# Altium schematic sheet Audio.SchDoc
size A4; DocumentNumber: 4; Revision: B.2(PCB.SCH); SheetNumber: 4; SheetTotal: 6
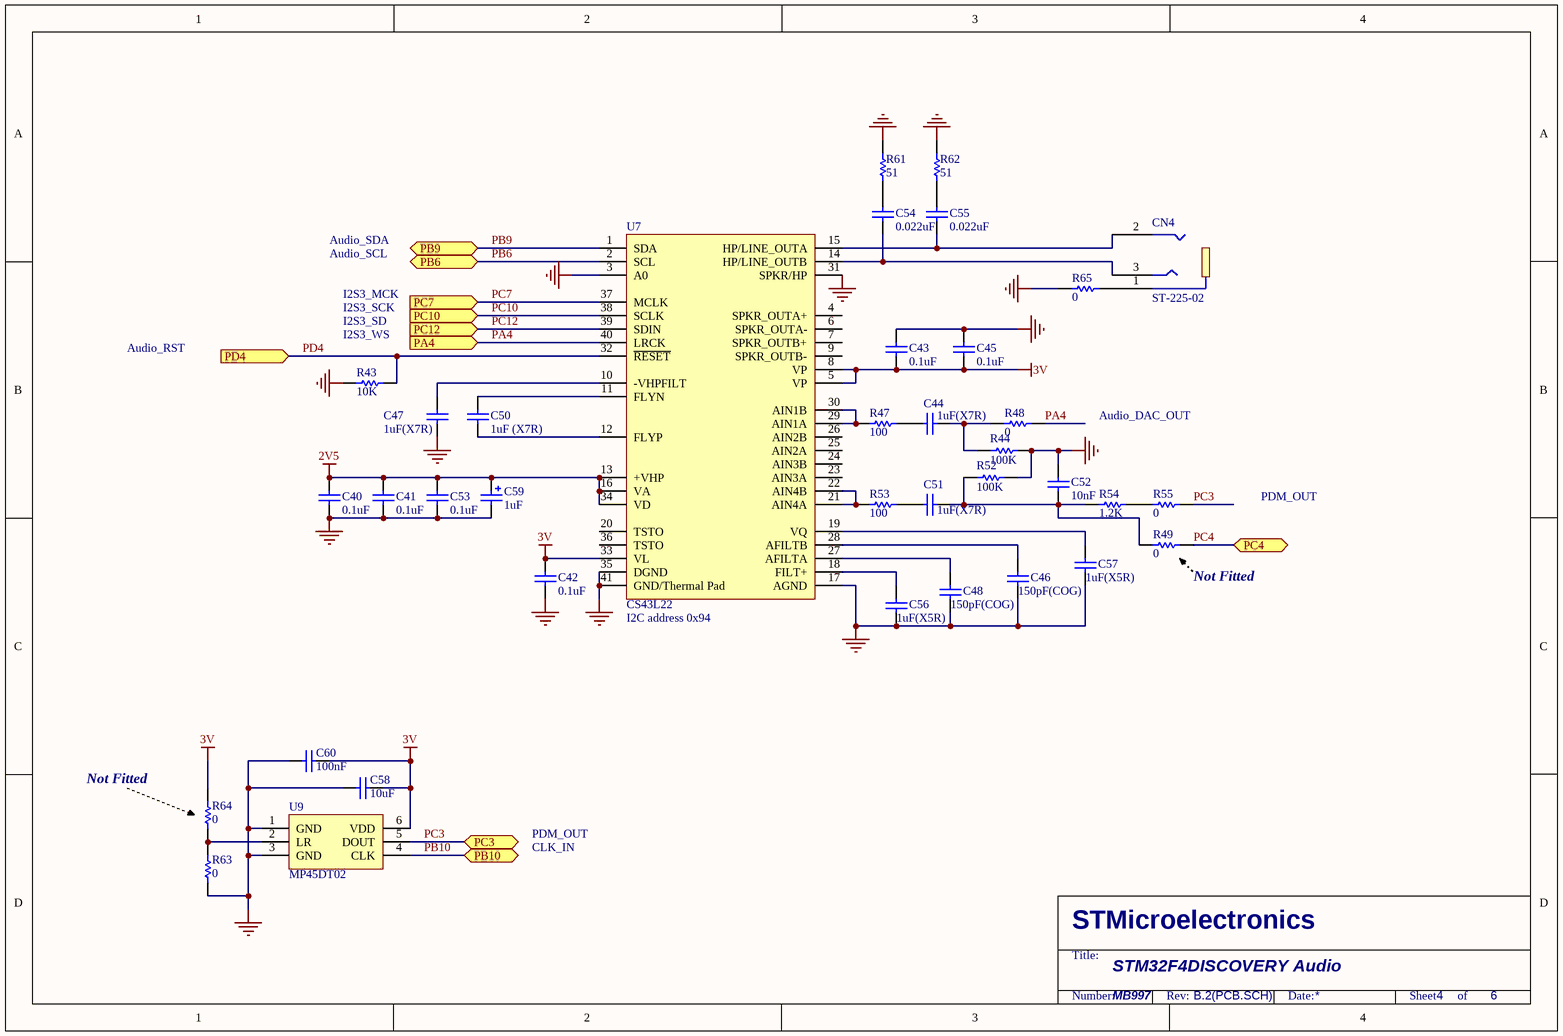
[diagram p0: Audio.SchDoc]

## Parts
C40  0.1uF  [0402C]
C41  0.1uF  [0402C]
C42  0.1uF  [0402C]
C43  0.1uF  [0402C]
C44  1uF(X7R)  [0603C]
C45  0.1uF  [0402C]
C46  150pF(COG)  [0603C]
C47  1uF(X7R)  [0603C]
C48  150pF(COG)  [0603C]
C50  1uF (X7R)  [0603C]
C51  1uF(X7R)  [0603C]
C52  10nF  [0603C]
C53  0.1uF  [0402C]
C54  0.022uF  [0603C]
C55  0.022uF  [0603C]
C56  1uF(X5R)  [0603C]
C57  1uF(X5R)  [0603C]
C58  10uF  [0603C]
C59  1uF  [TAN-A]
C60  100nF  [0603C]
CN4  ST-225-02  [Jack-ST-225]
R43  10K  [0402R]
R44  100K  [0402R]
R47  100  [0603R]
R48  0  [0402R]
R49  0  [0402R]
R52  100K  [0402R]
R53  100  [0603R]
R54  1.2K  [0603R]
R55  0  [0402R]
R61  51  [0603R]
R62  51  [0603R]
R63  0  [0402R]
R64  0  [0402R]
R65  0  [0402R]
U7  CS43L22  [QFN40]
U9  MP45DT02  [HLGA-4.72-3.76-6LD]

## Ports
PA4 (in), PB6 (bidir), PB9 (bidir), PB10, PC3, PC4, PC7 (in), PC10 (in), PC12 (in), PD4 (in)

## Nets
2V5: C40.2 C41.2 C53.2 C59.1 U7.13(+VHP) U7.16(VA) U7.34(VD)
3V: C42.2 C43.2 C45.2 C58.2 C60.2 R64.2 U7.5(VP) U7.8(VP) U7.33(VL) U9.6(VDD)
GND: C40.1 C41.1 C42.1 C43.1 C45.1 C46.1 C47.2 C48.1 C52.2 C53.1 C56.1 C57.1 C58.1 C59.2 C60.1 R43.2 R44.2 R52.2 R61.1 R62.1 R63.1 R65.2 U7.3(A0) U7.17(AGND) U7.31(SPKR/HP) U7.35(DGND) U7.41(GND/Thermal_Pad) U9.1(GND) U9.3(GND)
PA4: R48.1 U7.40(LRCK) ; port PA4
PB6: U7.2(SCL) ; port PB6
PB9: U7.1(SDA) ; port PB9
PB10: U9.4(CLK) ; port PB10
PC3: R55.1 U9.5(DOUT) ; port PC3
PC4: R49.1 ; port PC4
PC7: U7.37(MCLK) ; port PC7
PC10: U7.38(SCLK) ; port PC10
PC12: U7.39(SDIN) ; port PC12
PD4: R43.1 U7.32(~{RESET}) ; port PD4
NetC44_1: C44.1 R47.1
NetC44_2: C44.2 R44.1 R48.2
NetC46_2: C46.2 U7.28(AFILTB)
NetC47_1: C47.1 U7.10(-VHPFILT)
NetC48_2: C48.2 U7.27(AFILTA)
NetC50_1: C50.1 U7.12(FLYP)
NetC50_2: C50.2 U7.11(FLYN)
NetC51_1: C51.1 R53.1
NetC51_2: C51.2 C52.1 R49.2 R52.1 R54.1
NetC54_1: C54.1 R61.2
NetC54_2: C54.2 CN4.3 U7.14(HP/LINE_OUTB)
NetC55_1: C55.1 R62.2
NetC55_2: C55.2 CN4.2 U7.15(HP/LINE_OUTA)
NetC56_2: C56.2 U7.18(FILT+)
NetC57_2: C57.2 U7.19(VQ)
NetCN4_1: CN4.1 R65.1
NetR47_2: R47.2 U7.29(AIN1A) U7.30(AIN1B)
NetR53_2: R53.2 U7.21(AIN4A) U7.22(AIN4B)
NetR54_2: R54.2 R55.2
NetR63_2: R63.2 R64.1 U9.2(LR)

Not connected (* = marked no-connect by the designer): U7 4(SPKR_OUTA+) 6(SPKR_OUTA-) 7(SPKR_OUTB+) 9(SPKR_OUTB-) 20(TSTO) 23(AIN3A) 24(AIN3B) 25(AIN2A) 26(AIN2B) 36(TSTO)

## Notes on the sheet
- Audio_SDA
- Audio_SCL
- I2S3_MCK
- I2S3_SCK
- Audio_RST
- (near R43) I2S3_WS
- I2S3_SD
- Audio_DAC_OUT
- PDM_OUT
- (near R49) Not Fitted
- (near U7) I2C address 0x94
- (near R64) Not Fitted
- CLK_IN
- STM32F4DISCOVERY Audio
- MB997
- STMicroelectronics
- Title:
- Number:
- Rev:
- Date:
- Sheet       of

## Library data of the parts
C40-C48 C50-C58 = CAP: Capacitor; Value: 100nF; Published: 8-Jun-2000; Revision: July-2002: Re-released for DXP Platform.; Publisher: Altium Limited
C59 = Cap Pol1: Polarized Capacitor (Radial); Value: 47uF; Published: 8-Jun-2000; Revision: July-2002: Re-released for DXP Platform.; Publisher: Altium Limited
C60 = CAP: Capacitor; Published: 8-Jun-2000; Revision: July-2002: Re-released for DXP Platform.; Publisher: Altium Limited; Value: 100nF
CN4 = ST-225-02: Connector Jack 35mm; Manuf_1: XIEJIA Electronics; Order: ST-225-02; Manuf_Part_1: ST-225-02
R43 R44 R47 R48 R52 R53 R55 R61 R62 R65 = res1: Resistor; Value: 1K; Published: 8-Jun-2000; Revision: July-2002: Re-released for DXP Platform.; Publisher: Altium Limited
R49 = res1: Resistor; Value: 1K; Fitted: NO; Published: 8-Jun-2000; Revision: July-2002: Re-released for DXP Platform.; Publisher: Altium Limited
R54 R63 = res1: Resistor; Published: 8-Jun-2000; Revision: July-2002: Re-released for DXP Platform.; Publisher: Altium Limited
  R54: Value: 1.2K
  R63: Value: 0
R64 = res1: Resistor; Fitted: NO; Published: 8-Jun-2000; Revision: July-2002: Re-released for DXP Platform.; Publisher: Altium Limited; Value: 0
U7 = CS43L22: Low Power, Stereo DAC w/Headphone & Speaker Amps; Order: *; Manuf_1: *; Manuf_Part_1: *; Fooprint: *
U9 = MP45DT02: MEMS audio sensor, omnidirectional digital microphone; Manuf_1: STM; Provided: ST; Ref St: 9188006; Manuf_Part_1: MP45DT02; Order: *